# EAGLE design headamp (EAGLE 7.7.0)
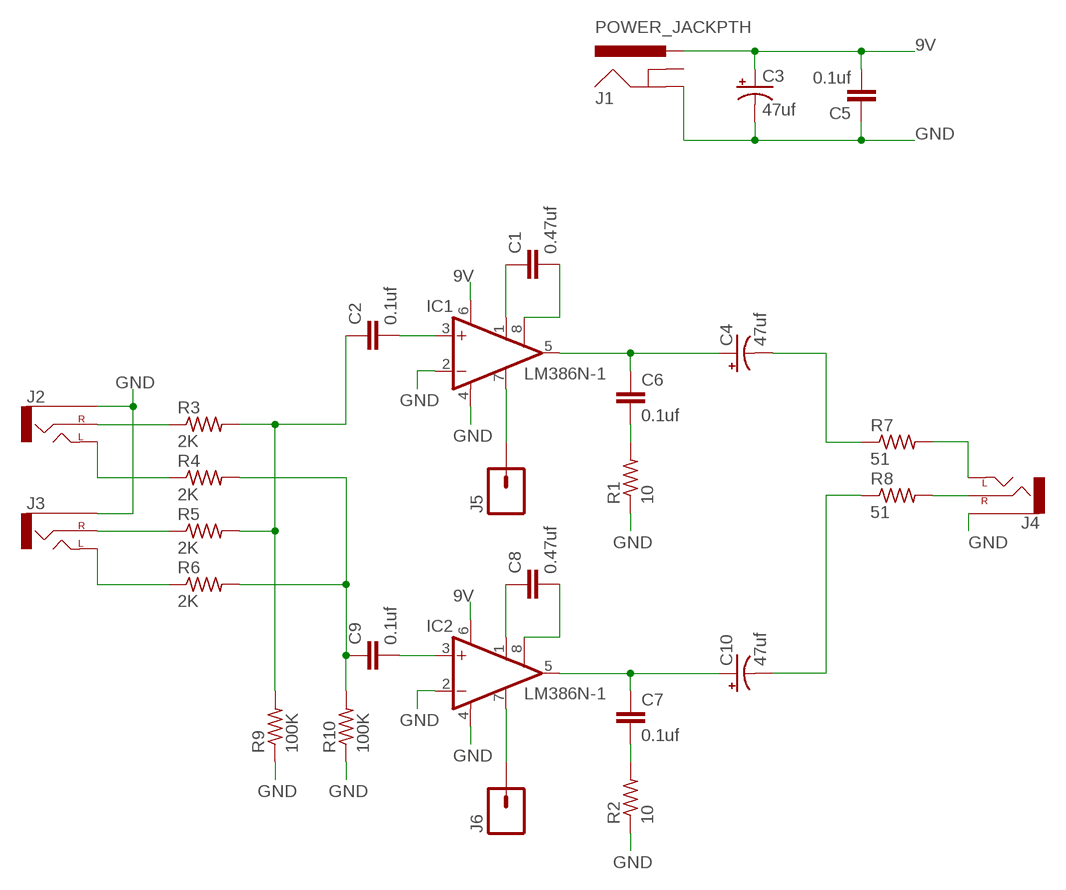
[diagram p0: schematic, sheet 1]

## Parts
C1  0.47uf  10UF50V20%(1210)  [1210]
C2  0.1uf  10UF50V20%(1210)  [1210]
C3  47uf  100UF-25V-20%(PTH)  [CPOL-RADIAL-100UF-25V]
C4  47uf  100UF-25V-20%(PTH)  [CPOL-RADIAL-100UF-25V]
C5  0.1uf  10UF50V20%(1210)  [1210]
C6  0.1uf  10UF50V20%(1210)  [1210]
C7  0.1uf  10UF50V20%(1210)  [1210]
C8  0.47uf  10UF50V20%(1210)  [1210]
C9  0.1uf  10UF50V20%(1210)  [1210]
C10  47uf  100UF-25V-20%(PTH)  [CPOL-RADIAL-100UF-25V]
IC1  LM386N-1  [DIL08]
IC2  LM386N-1  [DIL08]
J1  POWER_JACKPTH  [POWER_JACK_PTH]
J2  AUDIO-JACKPTH  [AUDIO-JACK]
J3  AUDIO-JACKPTH  [AUDIO-JACK]
J4  AUDIO-JACKPTH  [AUDIO-JACK]
J5  M01NOSILK-KIT  [1X01NS-KIT]
J6  M01NOSILK-KIT  [1X01NS-KIT]
R1  10  R-US_M0805  [M0805]
R2  10  R-US_M0805  [M0805]
R3  2K  R-US_M0805  [M0805]
R4  2K  R-US_M0805  [M0805]
R5  2K  R-US_M0805  [M0805]
R6  2K  R-US_M0805  [M0805]
R7  51  R-US_M0805  [M0805]
R8  51  R-US_M0805  [M0805]
R9  100K  R-US_M0805  [M0805]
R10  100K  R-US_M0805  [M0805]

## Nets
9V: C3.1(+) C5.2 IC1.6(VS) IC2.6(VS) J1.PWR
GND: C3.2(-) C5.1 IC1.2(-IN) IC1.4(GND) IC2.2(-IN) IC2.4(GND) J1.GND J2.SLEEVE J3.SLEEVE J4.SLEEVE R1.1 R2.1 R9.1 R10.1
LEFT: C2.1 R3.2 R5.2 R9.2
N$1: C1.1 IC1.1(GAIN)
N$2: C1.2 IC1.8(GAIN)
N$3: C2.2 IC1.3(+IN)
N$4: IC1.7(BYPASS) J5.1
N$5: J4.RING(RIGHT) R8.2
N$6: J4.TIP(LEFT) R7.2
N$7: C4.2(-) R7.1
N$8: C4.1(+) C6.1 IC1.5(OUT)
N$9: J2.RING(RIGHT) R3.1
N$10: J2.TIP(LEFT) R4.1
N$11: J3.RING(RIGHT) R5.1
N$12: J3.TIP(LEFT) R6.1
N$13: C6.2 R1.2
N$17: C10.2(-) R8.1
N$18: C8.1 IC2.1(GAIN)
N$19: C8.2 IC2.8(GAIN)
N$20: C9.2 IC2.3(+IN)
N$21: C7.1 C10.1(+) IC2.5(OUT)
N$22: C7.2 R2.2
N$23: IC2.7(BYPASS) J6.1
RIGHT: C9.1 R4.2 R6.2 R10.2
Unconnected: J1.GNDBREAK

## Library data of the parts
C1 C2 C5-C9 = SparkFun-Capacitors:10UF50V20%(1210): CAP-09824; PROD_ID: CAP-09824; VALUE: 10uF
C3 C4 C10 = SparkFun-Capacitors:100UF-25V-20%(PTH): CAP-08439; PROD_ID: CAP-08439
IC1 IC2 = linear:LM386?-*: Low Voltage Audio Power Amplifier Source: http://cache.national.com/ds/LM/LM386.pdf
J1 = SparkFun-Connectors:POWER_JACK: Power Jack This is the standard 5.5mm barrel jack for power. The PTH is the most common, proven, reliable, footprint. The Slot footprint only works if the mill layer is transmitted to the PCB fab house so be warned. Mating wall wart : TOL-00298 (and others); PROD_ID: CONN-08197
J2-J4 = SparkFun-Connectors:AUDIO-JACK: 3.5mm Audio Jack Simple 3.5mm common PCB mount audio jack. Variant PTH is our storefront SKU PRT-08032
J5 J6 = SparkFun-Connectors:M01: Header 1 Standard 1-pin 0.1" header. Use with straight break away headers (SKU : PRT-00116), right angle break away headers (PRT-00553), swiss pins (PRT-00743), machine pins (PRT-00117), and female headers (PRT-00115). SMTSO-256-ET is a "flush mount" nut for a 4-40 screw. The older package used to be too tight, and did not allow it to sit properly thru the drill hit. The latest (0.165DIA) fits nice and snug.
R1-R10 = resistor:R-US_: RESISTOR, American symbol

## Board
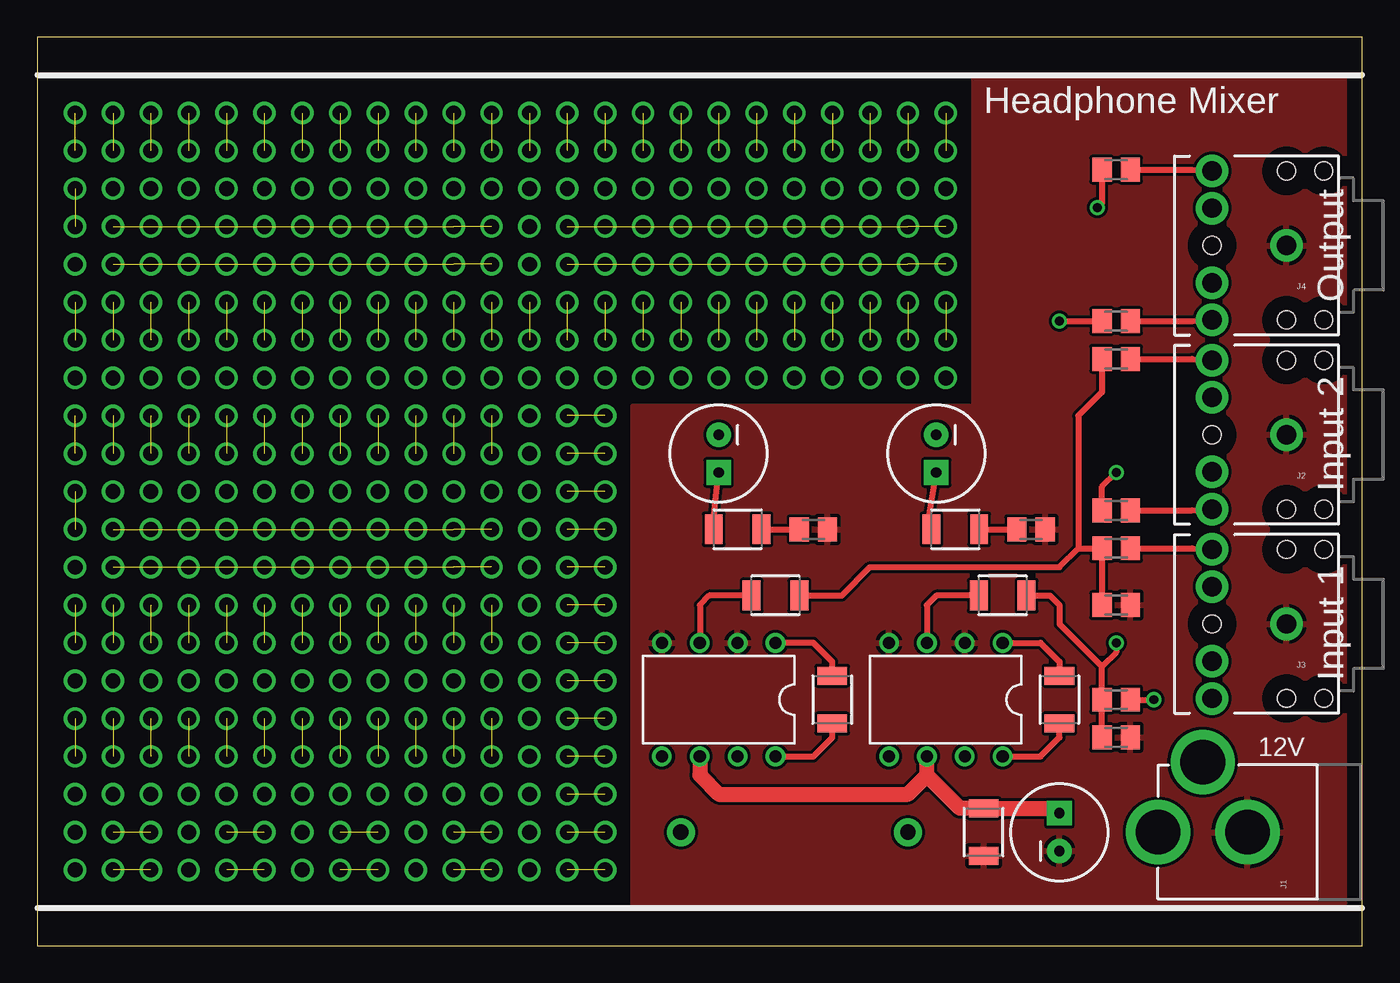
[diagram p1: board, top side]
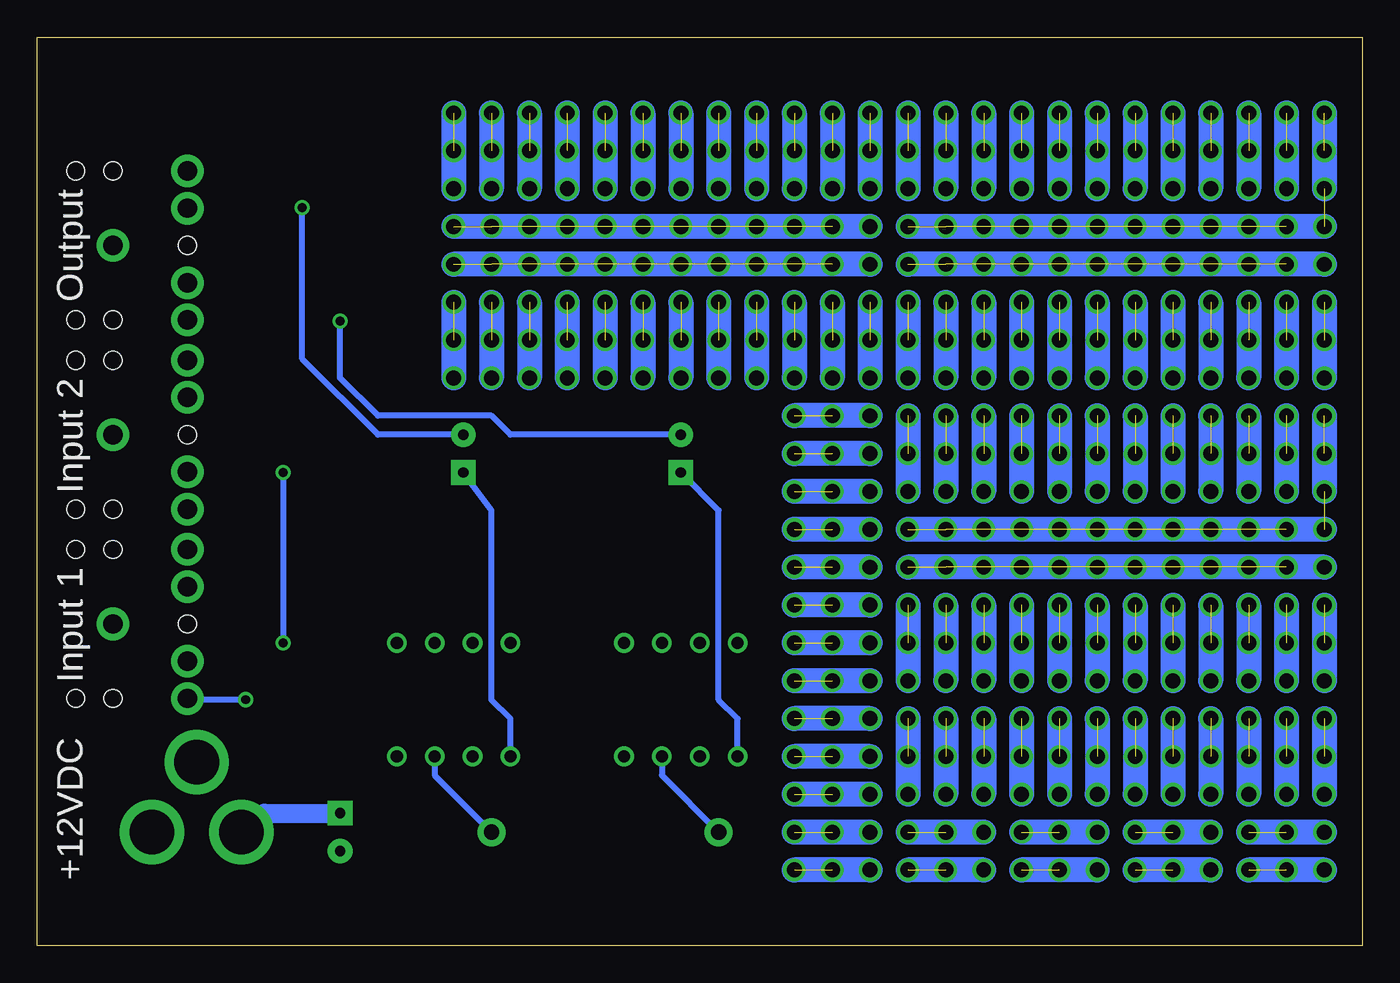
[diagram p2: board, bottom side, seen from below]

Size 88.9 x 60.96 mm. Coordinates in mm from the lower left corner, seen from the top.
Outline: 0,0 88.9,0 88.9,60.96 0,60.96 0,0
Copper layers (1*16): Top 0.035mm / dielectric 1.5mm / Bottom 0.035mm
Design rules "default": minimum track width 10mil, minimum drill 24mil, track to track 8mil, track to pad 8mil, pad to pad 8mil, via to via 8mil, smd to smd 8mil, copper to edge 40mil, drill to drill 8mil, minimum pad ring 10mil, minimum via ring 8mil, stop-mask expansion 4mil, vias tented up to drill 0mil, thermal gap 10mil

### Footprints (pad centres in the part's own frame; a part is rotated, then mirrored left to right if it is on the bottom)
1210 = smd 1.2 x 2: 1 -1.6,0; 2 1.6,0
CPOL-RADIAL-100UF-25V = drill 0.7 pad 1.651 square: 1 1.27,0 | drill 0.7 pad 1.651: 2 -1.27,0
DIL08 = drill 0.813 pad 1.27: 1 -3.81,-3.81; 2 -1.27,-3.81; 3 1.27,-3.81; 4 3.81,-3.81; 5 3.81,3.81; 6 1.27,3.81; 7 -1.27,3.81; 8 -3.81,3.81
POWER_JACK_PTH = drill 2.997 pad 4.318: GND 0,7.7; GNDBREAK 4.7,10.7; PWR 0,13.7
AUDIO-JACK = drill 1.3 pad 2.184: RING 5,5; RSH 5,2.5; SLEEVE 0,0; TIP 5,-5; TSH 5,-2.5 | hole 1.2: 0,5; -2.5,5; -2.5,-5; 0,-5; 5,0
1X01NS-KIT = drill 1.016 pad 1.88: 1 0,0
M0805 = smd 1.3 x 1.6: 1 -0.95,0; 2 0.95,0

### Placement (x,y rotation side)
C1  68.58,16.51 270 top
C2  64.77,23.5 180 top
C3  68.58,7.62 90 top
C4  60.33,33.02 270 top
C5  63.5,7.62 90 top
C6  61.59,27.94 0 top
C7  46.99,27.94 0 top
C8  53.34,16.51 270 top
C9  49.53,23.5 180 top
C10  45.72,33.02 270 top
IC1  60.96,16.51 180 top
IC2  45.72,16.51 180 top
J1  88.9,7.62 90 top
J2  83.82,34.29 180 top
J3  83.82,21.59 180 top
J4  83.82,46.99 180 top
J5  58.42,7.62 0 top
J6  43.18,7.62 0 top
R1  66.67,27.94 180 top
R2  52.07,27.94 180 top
R3  72.39,29.21 180 top
R4  72.39,39.37 180 top
R5  72.39,16.51 180 top
R6  72.39,26.67 180 top
R7  72.39,52.07 0 top
R8  72.39,41.91 0 top
R9  72.39,13.97 180 top
R10  72.39,22.86 180 top

### Tracks (layer width: path | path; a pad name or v marks a point on that pad's centre or on a via)
9V
  Top 1.016: 59.69,11.43 61.9,9.22 C5.2 68.25,9.22 C3.1 | 59.69,11.43 IC1.6 | IC2.6 44.45,11.43 45.72,10.16 58.42,10.16 59.69,11.43
  Bottom 1.27: J1.PWR 74.93,7.62 73.66,8.89 C3.1
GND
  pour Top: 62.87,58.42 88.9,58.42 88.9,2.54 40.01,2.54 40.01,36.2 62.87,36.2
GND1  (via drill 1)  (10 unrouted)
  Bottom 1.676: v2.54,45.72 v30.48,45.72
  other vias: 5.08,45.72 7.62,45.72 10.16,45.72 12.7,45.72 15.24,45.72 17.78,45.72 20.32,45.72 22.86,45.72 25.4,45.72 27.94,45.72
GND2  (via drill 1)  (10 unrouted)
  Bottom 1.676: v2.54,25.4 v30.48,25.4
  other vias: 5.08,25.4 7.62,25.4 10.16,25.4 12.7,25.4 15.24,25.4 17.78,25.4 20.32,25.4 22.86,25.4 25.4,25.4 27.94,25.4
GND3  (via drill 1)  (10 unrouted)
  Bottom 1.676: v33.02,45.72 v60.96,45.72
  other vias: 35.56,45.72 38.1,45.72 40.64,45.72 43.18,45.72 45.72,45.72 48.26,45.72 50.8,45.72 53.34,45.72 55.88,45.72 58.42,45.72
LEFT  (via drill 0.6)
  Top 0.406: R9.2 R5.2 71.44,18.73 | 71.44,18.73 68.58,21.59 68.58,22.86 67.94,23.5 C2.1 | R3.2 71.44,30.8 v72.39,31.75 | v72.39,20.32 72.39,19.68 71.44,18.73
  Bottom 0.406: v72.39,31.75 v72.39,20.32
N$1
  Top 0.406: IC1.1 67.31,20.32 68.58,19.05 C1.1
N$2
  Top 0.406: IC1.8 67.31,12.7 68.58,13.97 C1.2
N$3
  Top 0.406: C2.2 60.33,23.5 59.69,22.86 IC1.3
N$4
  Bottom 0.406: IC1.7 62.23,11.43 J5.1
N$5
  Top 0.406: R8.2 77.47,41.91 J4.RING
N$6
  Top 0.406: R7.2 77.47,52.07 J4.TIP
N$7  (via drill 0.6)
  Top 0.406: R7.1 71.44,49.85 v71.12,49.53
  Bottom 0.406: C4.2 66.04,34.29 71.12,39.37 v71.12,49.53
N$8
  Top 0.406: C6.1 59.69,27.94 C4.1
  Bottom 0.406: IC1.5 57.15,15.24 58.42,16.51 58.42,29.21 C4.1
N$9
  Top 0.406: R3.1 77.47,29.21 J2.RING
N$10
  Top 0.406: R4.1 77.47,39.37 J2.TIP
N$11  (via drill 0.6)
  Top 0.406: R5.1 v74.93,16.51
  Bottom 0.406: v74.93,16.51 78.74,16.51 J3.RING
N$12
  Top 0.406: R6.1 77.47,26.67 J3.TIP
N$13
  Top 0.406: C6.2 R1.2
N$14  (via drill 1)  (1 unrouted)
  Bottom 1.676: v12.7,43.18 v12.7,38.1
  other vias: 12.7,40.64
N$15  (via drill 1)  (1 unrouted)
  Bottom 1.676: v15.24,43.18 v15.24,38.1
  other vias: 15.24,40.64
N$16  (via drill 1)  (1 unrouted)
  Bottom 1.676: v17.78,43.18 v17.78,38.1
  other vias: 17.78,40.64
N$17  (via drill 0.6)
  Top 0.406: v68.58,41.91 R8.1
  Bottom 0.406: C10.2 57.15,34.29 58.42,35.56 66.04,35.56 68.58,38.1 v68.58,41.91
N$18
  Top 0.406: C8.1 53.34,19.05 52.07,20.32 IC2.1
N$19
  Top 0.406: IC2.8 52.07,12.7 53.34,13.97 C8.2
N$20
  Top 0.406: C9.2 45.09,23.5 44.45,22.86 IC2.3
N$21
  Top 0.406: C7.1 45.39,28.88 C10.1
  Bottom 0.406: IC2.5 41.91,15.24 43.18,16.51 43.18,29.21 C10.1
N$22
  Top 0.406: C7.2 R2.2
N$23
  Bottom 0.406: IC2.7 46.99,11.43 J6.1
N$24  (via drill 1)  (1 unrouted)
  Bottom 1.676: v20.32,43.18 v20.32,38.1
  other vias: 20.32,40.64
N$25  (via drill 1)  (1 unrouted)
  Bottom 1.676: v2.54,43.18 v2.54,38.1
  other vias: 2.54,40.64
N$26  (via drill 1)  (1 unrouted)
  Bottom 1.676: v5.08,43.18 v5.08,38.1
  other vias: 5.08,40.64
N$27  (via drill 1)  (1 unrouted)
  Bottom 1.676: v7.62,43.18 v7.62,38.1
  other vias: 7.62,40.64
N$28  (via drill 1)  (1 unrouted)
  Bottom 1.676: v10.16,43.18 v10.16,38.1
  other vias: 10.16,40.64
N$29  (via drill 1)  (1 unrouted)
  Bottom 1.676: v12.7,55.88 v12.7,50.8
  other vias: 12.7,53.34
N$30  (via drill 1)  (1 unrouted)
  Bottom 1.676: v15.24,55.88 v15.24,50.8
  other vias: 15.24,53.34
N$31  (via drill 1)  (1 unrouted)
  Bottom 1.676: v17.78,55.88 v17.78,50.8
  other vias: 17.78,53.34
N$32  (via drill 1)  (1 unrouted)
  Bottom 1.676: v20.32,55.88 v20.32,50.8
  other vias: 20.32,53.34
N$33  (via drill 1)  (1 unrouted)
  Bottom 1.676: v5.08,55.88 v5.08,50.8
  other vias: 5.08,53.34
N$34  (via drill 1)  (1 unrouted)
  Bottom 1.676: v7.62,55.88 v7.62,50.8
  other vias: 7.62,53.34
N$35  (via drill 1)  (1 unrouted)
  Bottom 1.676: v10.16,55.88 v10.16,50.8
  other vias: 10.16,53.34
N$36  (via drill 1)  (1 unrouted)
  Bottom 1.676: v22.86,43.18 v22.86,38.1
  other vias: 22.86,40.64
N$37  (via drill 1)  (1 unrouted)
  Bottom 1.676: v25.4,43.18 v25.4,38.1
  other vias: 25.4,40.64
N$38  (via drill 1)  (1 unrouted)
  Bottom 1.676: v27.94,43.18 v27.94,38.1
  other vias: 27.94,40.64
N$39  (via drill 1)  (1 unrouted)
  Bottom 1.676: v30.48,43.18 v30.48,38.1
  other vias: 30.48,40.64
N$40  (via drill 1)  (1 unrouted)
  Bottom 1.676: v22.86,55.88 v22.86,50.8
  other vias: 22.86,53.34
N$41  (via drill 1)  (1 unrouted)
  Bottom 1.676: v25.4,55.88 v25.4,50.8
  other vias: 25.4,53.34
N$42  (via drill 1)  (1 unrouted)
  Bottom 1.676: v27.94,55.88 v27.94,50.8
  other vias: 27.94,53.34
N$43  (via drill 1)  (1 unrouted)
  Bottom 1.676: v30.48,55.88 v30.48,50.8
  other vias: 30.48,53.34
N$44  (via drill 1)  (1 unrouted)
  Bottom 1.676: v12.7,22.86 v12.7,17.78
  other vias: 12.7,20.32
N$45  (via drill 1)  (1 unrouted)
  Bottom 1.676: v15.24,22.86 v15.24,17.78
  other vias: 15.24,20.32
N$46  (via drill 1)  (1 unrouted)
  Bottom 1.676: v17.78,22.86 v17.78,17.78
  other vias: 17.78,20.32
N$47  (via drill 1)  (1 unrouted)
  Bottom 1.676: v20.32,22.86 v20.32,17.78
  other vias: 20.32,20.32
N$48  (via drill 1)  (1 unrouted)
  Bottom 1.676: v2.54,22.86 v2.54,17.78
  other vias: 2.54,20.32
N$49  (via drill 1)  (1 unrouted)
  Bottom 1.676: v5.08,22.86 v5.08,17.78
  other vias: 5.08,20.32
N$50  (via drill 1)  (1 unrouted)
  Bottom 1.676: v7.62,22.86 v7.62,17.78
  other vias: 7.62,20.32
N$51  (via drill 1)  (1 unrouted)
  Bottom 1.676: v10.16,22.86 v10.16,17.78
  other vias: 10.16,20.32
N$52  (via drill 1)  (1 unrouted)
  Bottom 1.676: v12.7,35.56 v12.7,30.48
  other vias: 12.7,33.02
N$53  (via drill 1)  (1 unrouted)
  Bottom 1.676: v15.24,35.56 v15.24,30.48
  other vias: 15.24,33.02
N$54  (via drill 1)  (1 unrouted)
  Bottom 1.676: v17.78,35.56 v17.78,30.48
  other vias: 17.78,33.02
N$55  (via drill 1)  (1 unrouted)
  Bottom 1.676: v20.32,35.56 v20.32,30.48
  other vias: 20.32,33.02
N$56  (via drill 1)  (1 unrouted)
  Bottom 1.676: v5.08,35.56 v5.08,30.48
  other vias: 5.08,33.02
N$57  (via drill 1)  (1 unrouted)
  Bottom 1.676: v7.62,35.56 v7.62,30.48
  other vias: 7.62,33.02
N$58  (via drill 1)  (1 unrouted)
  Bottom 1.676: v10.16,35.56 v10.16,30.48
  other vias: 10.16,33.02
N$59  (via drill 1)  (1 unrouted)
  Bottom 1.676: v22.86,22.86 v22.86,17.78
  other vias: 22.86,20.32
N$60  (via drill 1)  (1 unrouted)
  Bottom 1.676: v25.4,22.86 v25.4,17.78
  other vias: 25.4,20.32
N$61  (via drill 1)  (1 unrouted)
  Bottom 1.676: v27.94,22.86 v27.94,17.78
  other vias: 27.94,20.32
N$62  (via drill 1)  (1 unrouted)
  Bottom 1.676: v30.48,22.86 v30.48,17.78
  other vias: 30.48,20.32
N$63  (via drill 1)  (1 unrouted)
  Bottom 1.676: v22.86,35.56 v22.86,30.48
  other vias: 22.86,33.02
N$64  (via drill 1)  (1 unrouted)
  Bottom 1.676: v25.4,35.56 v25.4,30.48
  other vias: 25.4,33.02
N$65  (via drill 1)  (1 unrouted)
  Bottom 1.676: v27.94,35.56 v27.94,30.48
  other vias: 27.94,33.02
N$66  (via drill 1)  (1 unrouted)
  Bottom 1.676: v30.48,35.56 v30.48,30.48
  other vias: 30.48,33.02
N$67  (via drill 1)  (12 unrouted)
  Bottom 1.676: v2.54,35.56 v2.54,30.48 | v2.54,27.94 v30.48,27.94
  other vias: 2.54,33.02 5.08,27.94 7.62,27.94 10.16,27.94 12.7,27.94 15.24,27.94 17.78,27.94 20.32,27.94 22.86,27.94 25.4,27.94 27.94,27.94
N$68  (via drill 1)  (1 unrouted)
  Bottom 1.676: v43.18,55.88 v43.18,50.8
  other vias: 43.18,53.34
N$69  (via drill 1)  (1 unrouted)
  Bottom 1.676: v45.72,55.88 v45.72,50.8
  other vias: 45.72,53.34
N$70  (via drill 1)  (1 unrouted)
  Bottom 1.676: v48.26,55.88 v48.26,50.8
  other vias: 48.26,53.34
N$71  (via drill 1)  (1 unrouted)
  Bottom 1.676: v50.8,55.88 v50.8,50.8
  other vias: 50.8,53.34
N$72  (via drill 1)  (1 unrouted)
  Bottom 1.676: v35.56,55.88 v35.56,50.8
  other vias: 35.56,53.34
N$73  (via drill 1)  (1 unrouted)
  Bottom 1.676: v38.1,55.88 v38.1,50.8
  other vias: 38.1,53.34
N$74  (via drill 1)  (1 unrouted)
  Bottom 1.676: v40.64,55.88 v40.64,50.8
  other vias: 40.64,53.34
N$75  (via drill 1)  (1 unrouted)
  Bottom 1.676: v53.34,55.88 v53.34,50.8
  other vias: 53.34,53.34
N$76  (via drill 1)  (1 unrouted)
  Bottom 1.676: v55.88,55.88 v55.88,50.8
  other vias: 55.88,53.34
N$77  (via drill 1)  (1 unrouted)
  Bottom 1.676: v58.42,55.88 v58.42,50.8
  other vias: 58.42,53.34
N$78  (via drill 1)  (1 unrouted)
  Bottom 1.676: v60.96,55.88 v60.96,50.8
  other vias: 60.96,53.34
N$79  (via drill 1)  (1 unrouted)
  Bottom 1.676: v33.02,55.88 v33.02,50.8
  other vias: 33.02,53.34
N$80  (via drill 1)  (1 unrouted)
  Bottom 1.676: v12.7,15.24 v12.7,10.16
  other vias: 12.7,12.7
N$81  (via drill 1)  (1 unrouted)
  Bottom 1.676: v15.24,15.24 v15.24,10.16
  other vias: 15.24,12.7
N$82  (via drill 1)  (1 unrouted)
  Bottom 1.676: v17.78,15.24 v17.78,10.16
  other vias: 17.78,12.7
N$83  (via drill 1)  (1 unrouted)
  Bottom 1.676: v20.32,15.24 v20.32,10.16
  other vias: 20.32,12.7
N$84  (via drill 1)  (1 unrouted)
  Bottom 1.676: v5.08,15.24 v5.08,10.16
  other vias: 5.08,12.7
N$85  (via drill 1)  (1 unrouted)
  Bottom 1.676: v7.62,15.24 v7.62,10.16
  other vias: 7.62,12.7
N$86  (via drill 1)  (1 unrouted)
  Bottom 1.676: v10.16,15.24 v10.16,10.16
  other vias: 10.16,12.7
N$87  (via drill 1)  (1 unrouted)
  Bottom 1.676: v22.86,15.24 v22.86,10.16
  other vias: 22.86,12.7
N$88  (via drill 1)  (1 unrouted)
  Bottom 1.676: v25.4,15.24 v25.4,10.16
  other vias: 25.4,12.7
N$89  (via drill 1)  (1 unrouted)
  Bottom 1.676: v27.94,15.24 v27.94,10.16
  other vias: 27.94,12.7
N$90  (via drill 1)  (1 unrouted)
  Bottom 1.676: v30.48,15.24 v30.48,10.16
  other vias: 30.48,12.7
N$91  (via drill 1)  (1 unrouted)
  Bottom 1.676: v2.54,15.24 v2.54,10.16
  other vias: 2.54,12.7
N$92  (via drill 1)  (1 unrouted)
  Bottom 1.676: v43.18,43.18 v43.18,38.1
  other vias: 43.18,40.64
N$93  (via drill 1)  (1 unrouted)
  Bottom 1.676: v45.72,43.18 v45.72,38.1
  other vias: 45.72,40.64
N$94  (via drill 1)  (1 unrouted)
  Bottom 1.676: v48.26,43.18 v48.26,38.1
  other vias: 48.26,40.64
N$95  (via drill 1)  (12 unrouted)
  Bottom 1.676: v2.54,55.88 v2.54,50.8 | v2.54,48.26 v30.48,48.26
  other vias: 2.54,53.34 5.08,48.26 7.62,48.26 10.16,48.26 12.7,48.26 15.24,48.26 17.78,48.26 20.32,48.26 22.86,48.26 25.4,48.26 27.94,48.26
N$96  (via drill 1)  (1 unrouted)
  Bottom 1.676: v50.8,43.18 v50.8,38.1
  other vias: 50.8,40.64
N$97  (via drill 1)  (1 unrouted)
  Bottom 1.676: v35.56,43.18 v35.56,38.1
  other vias: 35.56,40.64
N$98  (via drill 1)  (1 unrouted)
  Bottom 1.676: v38.1,43.18 v38.1,38.1
  other vias: 38.1,40.64
N$99  (via drill 1)  (1 unrouted)
  Bottom 1.676: v40.64,43.18 v40.64,38.1
  other vias: 40.64,40.64
N$100  (via drill 1)  (1 unrouted)
  Bottom 1.676: v53.34,43.18 v53.34,38.1
  other vias: 53.34,40.64
N$101  (via drill 1)  (1 unrouted)
  Bottom 1.676: v55.88,43.18 v55.88,38.1
  other vias: 55.88,40.64
N$102  (via drill 1)  (1 unrouted)
  Bottom 1.676: v58.42,43.18 v58.42,38.1
  other vias: 58.42,40.64
N$103  (via drill 1)  (1 unrouted)
  Bottom 1.676: v60.96,43.18 v60.96,38.1
  other vias: 60.96,40.64
N$104  (via drill 1)  (1 unrouted)
  Bottom 1.676: v33.02,43.18 v33.02,38.1
  other vias: 33.02,40.64
N$105  (via drill 1)  (10 unrouted)
  Bottom 1.676: v33.02,48.26 v60.96,48.26
  other vias: 35.56,48.26 38.1,48.26 40.64,48.26 43.18,48.26 45.72,48.26 48.26,48.26 50.8,48.26 53.34,48.26 55.88,48.26 58.42,48.26
N$106  (via drill 1)  (1 unrouted)
  Bottom 1.676: v33.02,35.56 v38.1,35.56
  other vias: 35.56,35.56
N$107  (via drill 1)  (1 unrouted)
  Bottom 1.676: v33.02,33.02 v38.1,33.02
  other vias: 35.56,33.02
N$108  (via drill 1)  (1 unrouted)
  Bottom 1.676: v33.02,30.48 v38.1,30.48
  other vias: 35.56,30.48
N$109  (via drill 1)  (1 unrouted)
  Bottom 1.676: v33.02,27.94 v38.1,27.94
  other vias: 35.56,27.94
N$110  (via drill 1)  (1 unrouted)
  Bottom 1.676: v33.02,25.4 v38.1,25.4
  other vias: 35.56,25.4
N$111  (via drill 1)  (1 unrouted)
  Bottom 1.676: v33.02,22.86 v38.1,22.86
  other vias: 35.56,22.86
N$112  (via drill 1)  (1 unrouted)
  Bottom 1.676: v33.02,20.32 v38.1,20.32
  other vias: 35.56,20.32
N$113  (via drill 1)  (1 unrouted)
  Bottom 1.676: v33.02,17.78 v38.1,17.78
  other vias: 35.56,17.78
N$114  (via drill 1)  (1 unrouted)
  Bottom 1.676: v33.02,15.24 v38.1,15.24
  other vias: 35.56,15.24
N$115  (via drill 1)  (1 unrouted)
  Bottom 1.676: v33.02,12.7 v38.1,12.7
  other vias: 35.56,12.7
N$116  (via drill 1)  (1 unrouted)
  Bottom 1.676: v33.02,10.16 v38.1,10.16
  other vias: 35.56,10.16
N$117  (via drill 1)  (1 unrouted)
  Bottom 1.676: v33.02,7.62 v38.1,7.62
  other vias: 35.56,7.62
N$118  (via drill 1)  (1 unrouted)
  Bottom 1.676: v33.02,5.08 v38.1,5.08
  other vias: 35.56,5.08
N$119  (via drill 1)  (1 unrouted)
  Bottom 1.676: v25.4,7.62 v30.48,7.62
  other vias: 27.94,7.62
N$120  (via drill 1)  (1 unrouted)
  Bottom 1.676: v25.4,5.08 v30.48,5.08
  other vias: 27.94,5.08
N$121  (via drill 1)  (1 unrouted)
  Bottom 1.676: v17.78,7.62 v22.86,7.62
  other vias: 20.32,7.62
N$122  (via drill 1)  (1 unrouted)
  Bottom 1.676: v17.78,5.08 v22.86,5.08
  other vias: 20.32,5.08
N$123  (via drill 1)  (1 unrouted)
  Bottom 1.676: v10.16,7.62 v15.24,7.62
  other vias: 12.7,7.62
N$124  (via drill 1)  (1 unrouted)
  Bottom 1.676: v10.16,5.08 v15.24,5.08
  other vias: 12.7,5.08
N$125  (via drill 1)  (1 unrouted)
  Bottom 1.676: v2.54,7.62 v7.62,7.62
  other vias: 5.08,7.62
N$126  (via drill 1)  (1 unrouted)
  Bottom 1.676: v2.54,5.08 v7.62,5.08
  other vias: 5.08,5.08
RIGHT
  Top 0.406: C9.1 53.98,23.5 55.88,25.4 68.58,25.4 69.85,26.67 | 69.85,26.67 R6.2 R10.2 | R4.2 71.44,37.15 69.85,35.56 69.85,26.67

### Text on the board
bPlace: Output | Input 2 | Input 1 | +12VDC
tNames: Headphone Mixer | Output | Input 2 | Input 1 | 12V